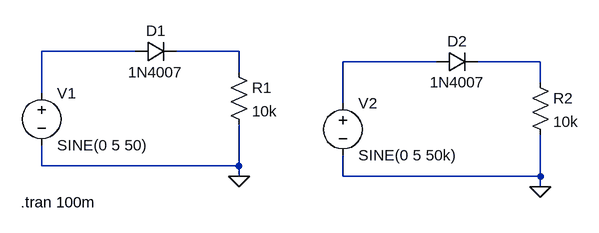
[diagram p0: schematic Simu punto C1.asc]
Simu punto C1.asc, the LTspice schematic file:
Version 4
SHEET 1 880 680
WIRE 112 80 -32 80
WIRE 272 80 176 80
WIRE 576 96 432 96
WIRE 736 96 640 96
WIRE 272 112 272 80
WIRE 736 128 736 96
WIRE -32 144 -32 80
WIRE 432 160 432 96
WIRE -32 256 -32 224
WIRE 272 256 272 192
WIRE 272 256 -32 256
WIRE 272 272 272 256
WIRE 432 272 432 240
WIRE 736 272 736 208
WIRE 736 272 432 272
WIRE 736 288 736 272
FLAG 272 272 0
FLAG 736 288 0
SYMBOL voltage -32 128 R0
WINDOW 123 0 0 Left 0
WINDOW 39 0 0 Left 0
SYMATTR InstName V1
SYMATTR Value SINE(0 5 50)
SYMBOL diode 112 96 R270
WINDOW 0 32 32 VTop 2
WINDOW 3 0 32 VBottom 2
SYMATTR InstName D1
SYMATTR Value 1N4007
SYMBOL res 256 96 R0
SYMATTR InstName R1
SYMATTR Value 10k
SYMBOL voltage 432 144 R0
WINDOW 123 0 0 Left 0
WINDOW 39 0 0 Left 0
SYMATTR InstName V2
SYMATTR Value SINE(0 5 50k)
SYMBOL diode 576 112 R270
WINDOW 0 32 32 VTop 2
WINDOW 3 0 32 VBottom 2
SYMATTR InstName D2
SYMATTR Value 1N4007
SYMBOL res 720 112 R0
SYMATTR InstName R2
SYMATTR Value 10k
TEXT -64 312 Left 2 !.tran 100m

The netlist it stands for:
* Simu punto C1.asc
V1 N001 0 SINE(0 5 50)
D1 N001 N002 1N4007
R1 N002 0 10k
V2 N003 0 SINE(0 5 50k)
D2 N003 N004 1N4007
R2 N004 0 10k
.model D D
.lib standard.dio
.tran 100m
.backanno
.end